# Altium schematic sheet TTFT2.SchDoc
size A3
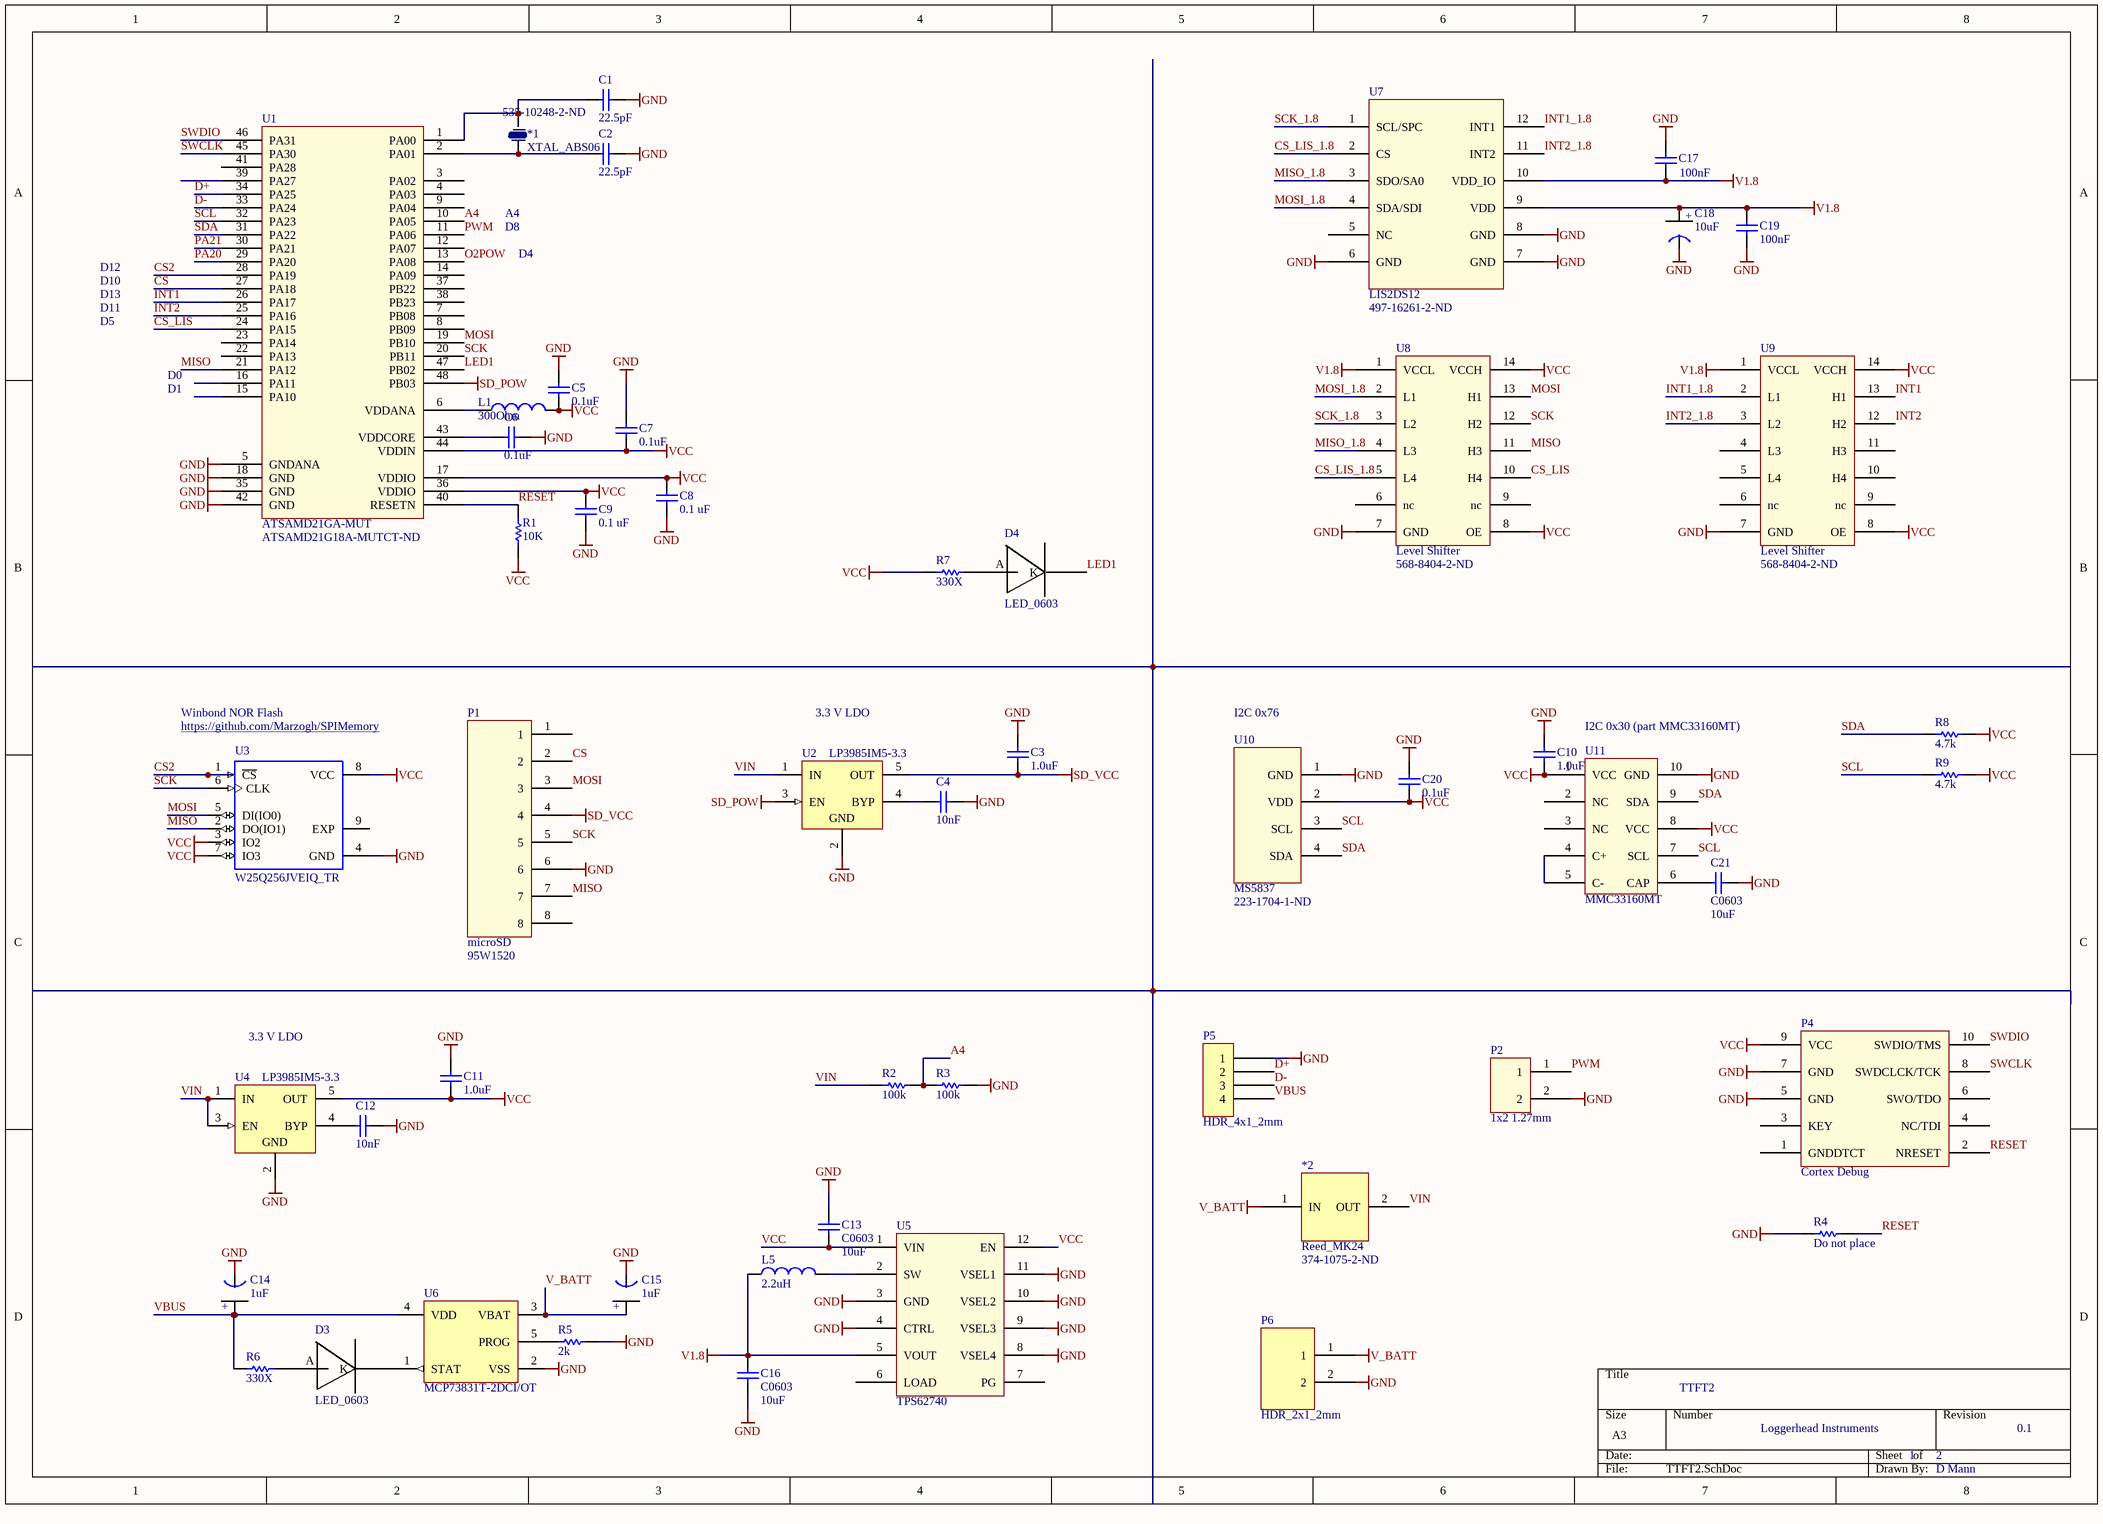
[diagram p0: TTFT2.SchDoc]

## Parts
*1  XTAL_ABS06  Supplier Part Number 1: 535-10248-2-ND  [XTAL-ABS06]
*2  Reed_MK24  Supplier Part Number 1: 374-1075-2-ND  [Reed MK24-B-3]
C1  22.5pF  [0402]
C2  22.5pF  [0402]
C3  1.0uF  [0402]
C4  10nF  [0402]
C5  0.1uF  [0402]
C6  0.1uF  [0402]
C7  0.1uF  [0402]
C8  0.1 uF  [0402]
C9  0.1 uF  [0402]
C10  1.0uF  [0402]
C11  1.0uF  [0402]
C12  10nF  [0402]
C13  C0603  value 10uF  [0603]
C14  1uF  [Tant0805]
C15  1uF  [Tant0805]
C16  C0603  value 10uF  [0603]
C17  100nF  [0402]
C18  10uF  [Tant0805]
C19  100nF  [0402]
C20  0.1uF  [0402]
C21  C0603  value 10uF  [0603]
D3  LED_0603  [Diode0603]
D4  LED_0603  [Diode0603]
L1  300Ohm  [0805 (M2125) Ferrite]
L5  2.2uH  [Inductor KLZ1608AHR]
P1  microSD  Supplier Part Number 1: 95W1520  [Molex microSD]
P2  1x2 1.27mm  [Header1x2 1.27mm]
P4  Cortex Debug  [Header_2x5_50mil]
P5  HDR_4x1_2mm  [Hdr_4x1_2mm]
P6  HDR_2x1_2mm  [HDR_2x1_2mm]
R1  10K  [3-0603]
R2  100k  [3-0603]
R3  100k  [3-0603]
R4  Do not place  [3-0603]
R5  2k  [3-0603]
R6  330X  [3-0603]
R7  330X  [3-0603]
R8  4.7k  [3-0603]
R9  4.7k  [3-0603]
U1  ATSAMD21GA-MUT  Supplier Part Number 1: ATSAMD21G18A-MUTCT-ND  [QFN127P600-8N]
U2  LP3985IM5-3.3  [MF05A_N]
U3  W25Q256JVEIQ_TR  [*SON127P800X600X80-9N]
U4  LP3985IM5-3.3  [MF05A_N]
U5  TPS62740  [TPS6274x]
U6  MCP73831T-2DCI/OT  [SOT-23-OT5_N]
U7  LIS2DS12  Supplier Part Number 1: 497-16261-2-ND  [LGA-12]
U8  Level Shifter  Supplier Part Number 1: 568-8404-2-ND  [DHVQFN14]
U9  Level Shifter  Supplier Part Number 1: 568-8404-2-ND  [DHVQFN14]
U10  MS5837  Supplier Part Number 1: 223-1704-1-ND  [MS5837]
U11  MMC33160MT  [MMC33160MT]

## Nets
GND: C1.1 C2.1 C3.2 C4.1 C5.2 C6.2 C7.2 C8.2 C9.2 C10.2 C11.2 C12.1 C13.2 C14.1(GND) C15.1(GND) C16.1 C17.2 C18.1(GND) C19.2 C20.2 C21.1 P1.6 P2.2 P4.5(GND) P4.7(GND) P5.1 P6.2 R3.1 R4.2 R5.1 U1.5(GNDANA) U1.18(GND) U1.35(GND) U1.42(GND) U2.2(GND) U3.4(GND) U4.2(GND) U5.3(GND) U5.4(CTRL) U5.8(VSEL4) U5.9(VSEL3) U5.10(VSEL2) U5.11(VSEL1) U6.2(VSS) U7.6(GND) U7.7(GND) U7.8(GND) U8.7(GND) U9.7(GND) U10.1(GND) U11.10(GND)
SD_POW: U1.48(PB03) U2.3(EN)
SD_VCC: C3.1 P1.4 U2.5(OUT)
V1.8: C16.2 C17.1 C18.2(+) C19.1 L5.1 U5.5(VOUT) U7.9(VDD) U7.10(VDD_IO) U8.1(VCCL) U9.1(VCCL)
V_BATT: *2.1(IN) C15.2(+) P6.1 U6.3(VBAT)
VCC: C5.1 C7.1 C8.1 C9.1 C10.1 C11.1 C13.1 C20.1 L1.2 P4.9(VCC) R1.1 R7.1 R8.1 R9.2 U1.17(VDDIO) U1.36(VDDIO) U1.44(VDDIN) U3.3(IO2) U3.7(IO3) U3.8(VCC) U4.5(OUT) U5.1(VIN) U5.12(EN) U8.8(OE) U8.14(VCCH) U9.8(OE) U9.14(VCCH) U10.2(VDD) U11.1(VCC) U11.8(VCC)
A4: R2.1 R3.2 U1.10(PA05)
CS: P1.2 U1.27(PA18)
CS2: U1.28(PA19) U3.1(~{CS})
CS_LIS: U1.24(PA15) U8.10(H4)
CS_LIS_1.8: U7.2(CS) U8.5(L4)
D+: P5.2 U1.34(PA25)
D-: P5.3 U1.33(PA24)
INT1: U1.26(PA17) U9.13(H1)
INT1_1.8: U7.12(INT1) U9.2(L1)
INT2: U1.25(PA16) U9.12(H2)
INT2_1.8: U7.11(INT2) U9.3(L2)
LED1: D4.K U1.47(PB02)
MISO: P1.7 U1.21(PA12) U3.2(DO(IO1)) U8.11(H3)
MISO_1.8: U7.3(SDO/SA0) U8.4(L3)
MOSI: P1.3 U1.19(PB10) U3.5(DI(IO0)) U8.13(H1)
MOSI_1.8: U7.4(SDA/SDI) U8.2(L1)
O2POW: U1.13(PA08)
PA20: U1.29(PA20)
PA21: U1.30(PA21)
PWM: P2.1 U1.11(PA06)
RESET: P4.2(NRESET) R1.2 R4.1 U1.40(RESETN)
SCK: P1.5 U1.20(PB11) U3.6(CLK) U8.12(H2)
SCK_1.8: U7.1(SCL/SPC) U8.3(L2)
SCL: R9.1 U1.32(PA23) U10.3(SCL) U11.7(SCL)
SDA: R8.2 U1.31(PA22) U10.4(SDA) U11.9(SDA)
SWCLK: P4.8(SWDCLCK/TCK) U1.45(PA30)
SWDIO: P4.10(SWDIO/TMS) U1.46(PA31)
VBUS: C14.2(+) P5.4 R6.1 U6.4(VDD)
VIN: *2.2(OUT) R2.2 U2.1(IN) U4.1(IN) U4.3(EN)
Net*1_1: *1.1 C2.2 U1.2(PA01)
Net*1_2: *1.2 C1.2 U1.1(PA00)
NetC4_2: C4.2 U2.4(BYP)
NetC6_1: C6.1 U1.43(VDDCORE)
NetC12_2: C12.2 U4.4(BYP)
NetC21_2: C21.2 U11.6(CAP)
NetD3_A: D3.A R6.2
NetD3_K: D3.K U6.1(STAT)
NetD4_A: D4.A R7.2
NetL1_1: L1.1 U1.6(VDDANA)
NetL5_2: L5.2 U5.2(SW)
NetR5_2: R5.2 U6.5(PROG)
NetU11_4: U11.4(C+) U11.5(C-)

Not connected (* = marked no-connect by the designer): P1 1 8; P4 1(GNDDTCT) 3(KEY) 4(NC/TDI) 6(SWO/TDO); U1 3(PA02) 4(PA03) 7(PB08) 8(PB09) 9(PA04) 12(PA07) 14(PA09) 15(PA10) 16(PA11) 22(PA13) 23(PA14) 37(PB22) 38(PB23) 39(PA27) 41(PA28); U3 9(EXP); U5 6(LOAD) 7(PG); U7 5(NC); U8 6(nc) 9(nc); U9 4(L3) 5(L4) 6(nc) 9(nc) 10(H4) 11(H3); U11 2(NC) 3(NC)

## Notes on the sheet
- D8
- A4
- D10
- D13
- D12
- D11
- D4
- D5
- D0
- D1
- Winbond NOR Flash
- 3.3 V LDO
- I2C 0x76
- (near U3) https://github.com/Marzogh/SPIMemory
- I2C 0x30 (part MMC33160MT)
- TTFT2
- Loggerhead Instruments
- 1
- 2
- 0.1
- D Mann

## Library data of the parts
C1 C2 = C0402: Ceramic Chip Capacitor - Standard; Note: Footprint corresponds to dimensions for bulk cassette packaging. This case size has tightened tolerances.; Value: 12.5; Published: 17-Jul-2002; LatestRevisionDate: 19-Mar-2004; LatestRevisionNote: Silkscreen size reduced.; DatasheetDocument: Mar-2001; PackageDocument: Mar-2001; PackageReference: 0402; Publisher: Altium Limited; Code_JEITA: 0402; Code_IPC: 1005 [0402]; ComponentLink1Description: Manufacturer Link; ComponentLink1URL: http://www.kemet.com/; ComponentLink2Description: Datasheet; ComponentLink2URL: http://www.kemet.com/kemet/web/homepage/kechome.nsf/vapubfilesname/F3102TA.pdf/$file/F3102TA.pdf
C3-C7 C10-C12 C20 = C0402: Ceramic Chip Capacitor - Standard; Note: Footprint corresponds to dimensions for bulk cassette packaging. This case size has tightened tolerances.; Published: 17-Jul-2002; LatestRevisionDate: 19-Mar-2004; LatestRevisionNote: Silkscreen size reduced.; DatasheetDocument: Mar-2001; PackageDocument: Mar-2001; PackageReference: 0402; Publisher: Altium Limited; Code_JEITA: 0402; Code_IPC: 1005 [0402]; ComponentLink1Description: Manufacturer Link; ComponentLink1URL: http://www.kemet.com/; ComponentLink2Description: Datasheet; ComponentLink2URL: http://www.kemet.com/kemet/web/homepage/kechome.nsf/vapubfilesname/F3102TA.pdf/$file/F3102TA.pdf
  C3 C10 C11: Value: 1.0uF
  C4 C12: Value: 10nF
  C5-C7 C20: Value: 0.1uF
C8 C9 = C0402: Ceramic Chip Capacitor - Standard; Note: Footprint corresponds to dimensions for bulk cassette packaging. This case size has tightened tolerances.; Value: 0.1uF; Published: 17-Jul-2002; LatestRevisionDate: 19-Mar-2004; LatestRevisionNote: Silkscreen size reduced.; DatasheetDocument: Mar-2001; PackageDocument: Mar-2001; PackageReference: 0402; Publisher: Altium Limited; Code_JEITA: 0402; Code_IPC: 1005 [0402]; ComponentLink1Description: Manufacturer Link; ComponentLink1URL: http://www.kemet.com/; ComponentLink2Description: Datasheet; ComponentLink2URL: http://www.kemet.com/kemet/web/homepage/kechome.nsf/vapubfilesname/F3102TA.pdf/$file/F3102TA.pdf
C13 C16 C21 = C0603: Ceramic Chip Capacitor - Standard; Note: Footprint corresponds to dimensions for bulk cassette packaging. This case size has tightened tolerances.; Published: 17-Jul-2002; LatestRevisionDate: 19-Mar-2004; LatestRevisionNote: Silkscreen size reduced.; DatasheetDocument: Mar-2001; PackageDocument: Mar-2001; PackageReference: 0603; Publisher: Altium Limited; Code_JEITA: 0603; Code_IPC: 1608 [0603]; ComponentLink1Description: Manufacturer Link; ComponentLink1URL: http://www.kemet.com/; ComponentLink2Description: Datasheet; ComponentLink2URL: http://www.kemet.com/kemet/web/homepage/kechome.nsf/vapubfilesname/F3102TA.pdf/$file/F3102TA.pdf
C14 C15 C18 = Tant0805
  C14 C15: Value: *
  C18: Value: 10uF
C17 C19 = C0402: Ceramic Chip Capacitor - Standard; Note: Footprint corresponds to dimensions for bulk cassette packaging. This case size has tightened tolerances.; Value: 100pF; Published: 17-Jul-2002; LatestRevisionDate: 19-Mar-2004; LatestRevisionNote: Silkscreen size reduced.; DatasheetDocument: Mar-2001; PackageDocument: Mar-2001; PackageReference: 0402; Publisher: Altium Limited; Code_JEITA: 0402; Code_IPC: 1005 [0402]; ComponentLink1Description: Manufacturer Link; ComponentLink1URL: http://www.kemet.com/; ComponentLink2Description: Datasheet; ComponentLink2URL: http://www.kemet.com/kemet/web/homepage/kechome.nsf/vapubfilesname/F3102TA.pdf/$file/F3102TA.pdf
L1 = Ferrite 0805(M2125) 3A: Ferrite 25mOhm@DC,  60 Ohm@100MHz; Fabrication Tested: NO; Creator and Date: Design Engineer's Name; Footprint Verified By: *; Schematic Verified By: *; Vendor Info Verified By: *; Value: 300Ohm; HelpURL: http://www.yuden.co.jp/ut/product/pdf/mlci08_e.pdf; Mass (place origin at center): *; Supplier 1: Digi-Key; Supplier Part Number 1: 587-1932-1-ND; Supplier 2: Newark; Supplier Part Number 2: 73M9170
L5 = Inductor KLZ1608: Supplier 1: Mouser; Supplier Part Number 1: 810-KLZ1608AHR2R2WTD
P1 = microSD Molex tiny: Supplier 1: Newark
P2 = Header 1x2 1.27mm
P4 = CortexDebug
R1-R9 = ERJ3RK: Precision Thick Film Chip Resistor, 10 Ohm to 1M Ohm Range, 1% and 0.5% Tolerance, 0603 Size, 0.063 W; Published: 17-Dec-2003; LatestRevisionDate: 19-Mar-2004; LatestRevisionNote: Silkscreen size reduced.; PackageDocument: Mar-2003; PackageReference: 3-0603; Publisher: Altium Limited; Code_IPC: 1608 [0603]; ComponentLink1Description: Manufacturer Link; ComponentLink1URL: http://www.panasonic.com/industrial/components/resistive_products.htm; ComponentLink2Description: Datasheet; ComponentLink2URL: http://www.panasonic.com/industrial/components/pdf/AOA0000CE2.pdf
U1 = ATSAMD21G18: Supplier 1: Digi-Key
U2 U4 = LP3985IM5-3.3: Micropower, 150mA Low-Noise Ultra Low-Dropout CMOS Voltage Regulator, 5-pin SOT-23; Manufacturer: National Semiconductor; CompType: LDO IC; PackageTopMarking: LDQB*XTT; PowerWise: N; Published: 4-Dec-2008; DatasheetVersion: Aug-2005; PackageVersion: revD, Aug-2008; PackageReference: MF05A; Publisher: Altium Limited; PackageDescription: Molded SOT-23, .115 x .063 x .040 in Body, 5 Lead, .0375 in Pitch; PartNumber: LP3985IM5-3.3; RoHS: N; PinCount: 5; ComponentLink1Description: LP3985 Datasheet; ComponentLink1URL: http://www.national.com/ds/LP/LP3985.pdf; ComponentLink2Description: LP3985 Web Page; ComponentLink2URL: http://www.national.com/pf/LP/LP3985.html; ComponentLink3Description: MF05A Package Page; ComponentLink3URL: http://www.national.com/packaging/folders/mf05a.html; Supplier 1: Farnell; Supplier Part Number 1: 4418694
U3 = W25Q256JVEIQ_TR: Ic Flash 256mbit 104mhz 8wson; MF: Winbond; MP: W25Q256JVEIQ TR; SnapEDA_Link: https://www.snapeda.com/parts/W25Q256JVEIQ%20TR/Winbond%20Electronics/view-part/?ref=snap; Price: None; Availability: Unavailable; Package: WSON-8 Winbond; Value: *
U5 = TPS6274x: Supplier 1: Farnell
U6 = MCP73831T-2DCI/OT: Miniature Single-Cell, Fully Integrated Li-Ion, Li-Polymer Charge Management Controller, 4.2V, 5-Pin SOT-23, Industrial Temperature, Tape and Reel; DatasheetVersion: revE, Sep-2008; PackageVersion: revBB, Aug-2009; PackageReference: SOT-23-OT5; PackageDescription: 5-Lead Plastic Small Outline Transistor (OT) [SOT-23]; Code_IPC: SOT23-5; ComponentLink1Description: Manufacturer URL; ComponentLink1URL: http://www.microchip.com/; ComponentLink2Description: Datasheet; ComponentLink2URL: http://ww1.microchip.com/downloads/en/DeviceDoc/21984e.pdf; ComponentLink3Description: Package Specification; ComponentLink3URL: http://www.microchip.com/stellent/groups/techpub_sg/documents/packagingspec/en012702.pdf
U8 U9 = NTB0104: Voltage level translator; Supplier 1: Digi-Key
U10 = MS5837: Pressure/Temp; Supplier 1: Digi-Key
*1 = XTAL_ABS06: Supplier 1: Digi-Key
*2 = Reed_MK24: Supplier 1: Digi-Key
U7 = LIS2DS12: Supplier 1: Digi-Key